# Altium schematic sheet Power_interconnect.SchDoc
size A3; SheetNumber: 3; SheetTotal: 6
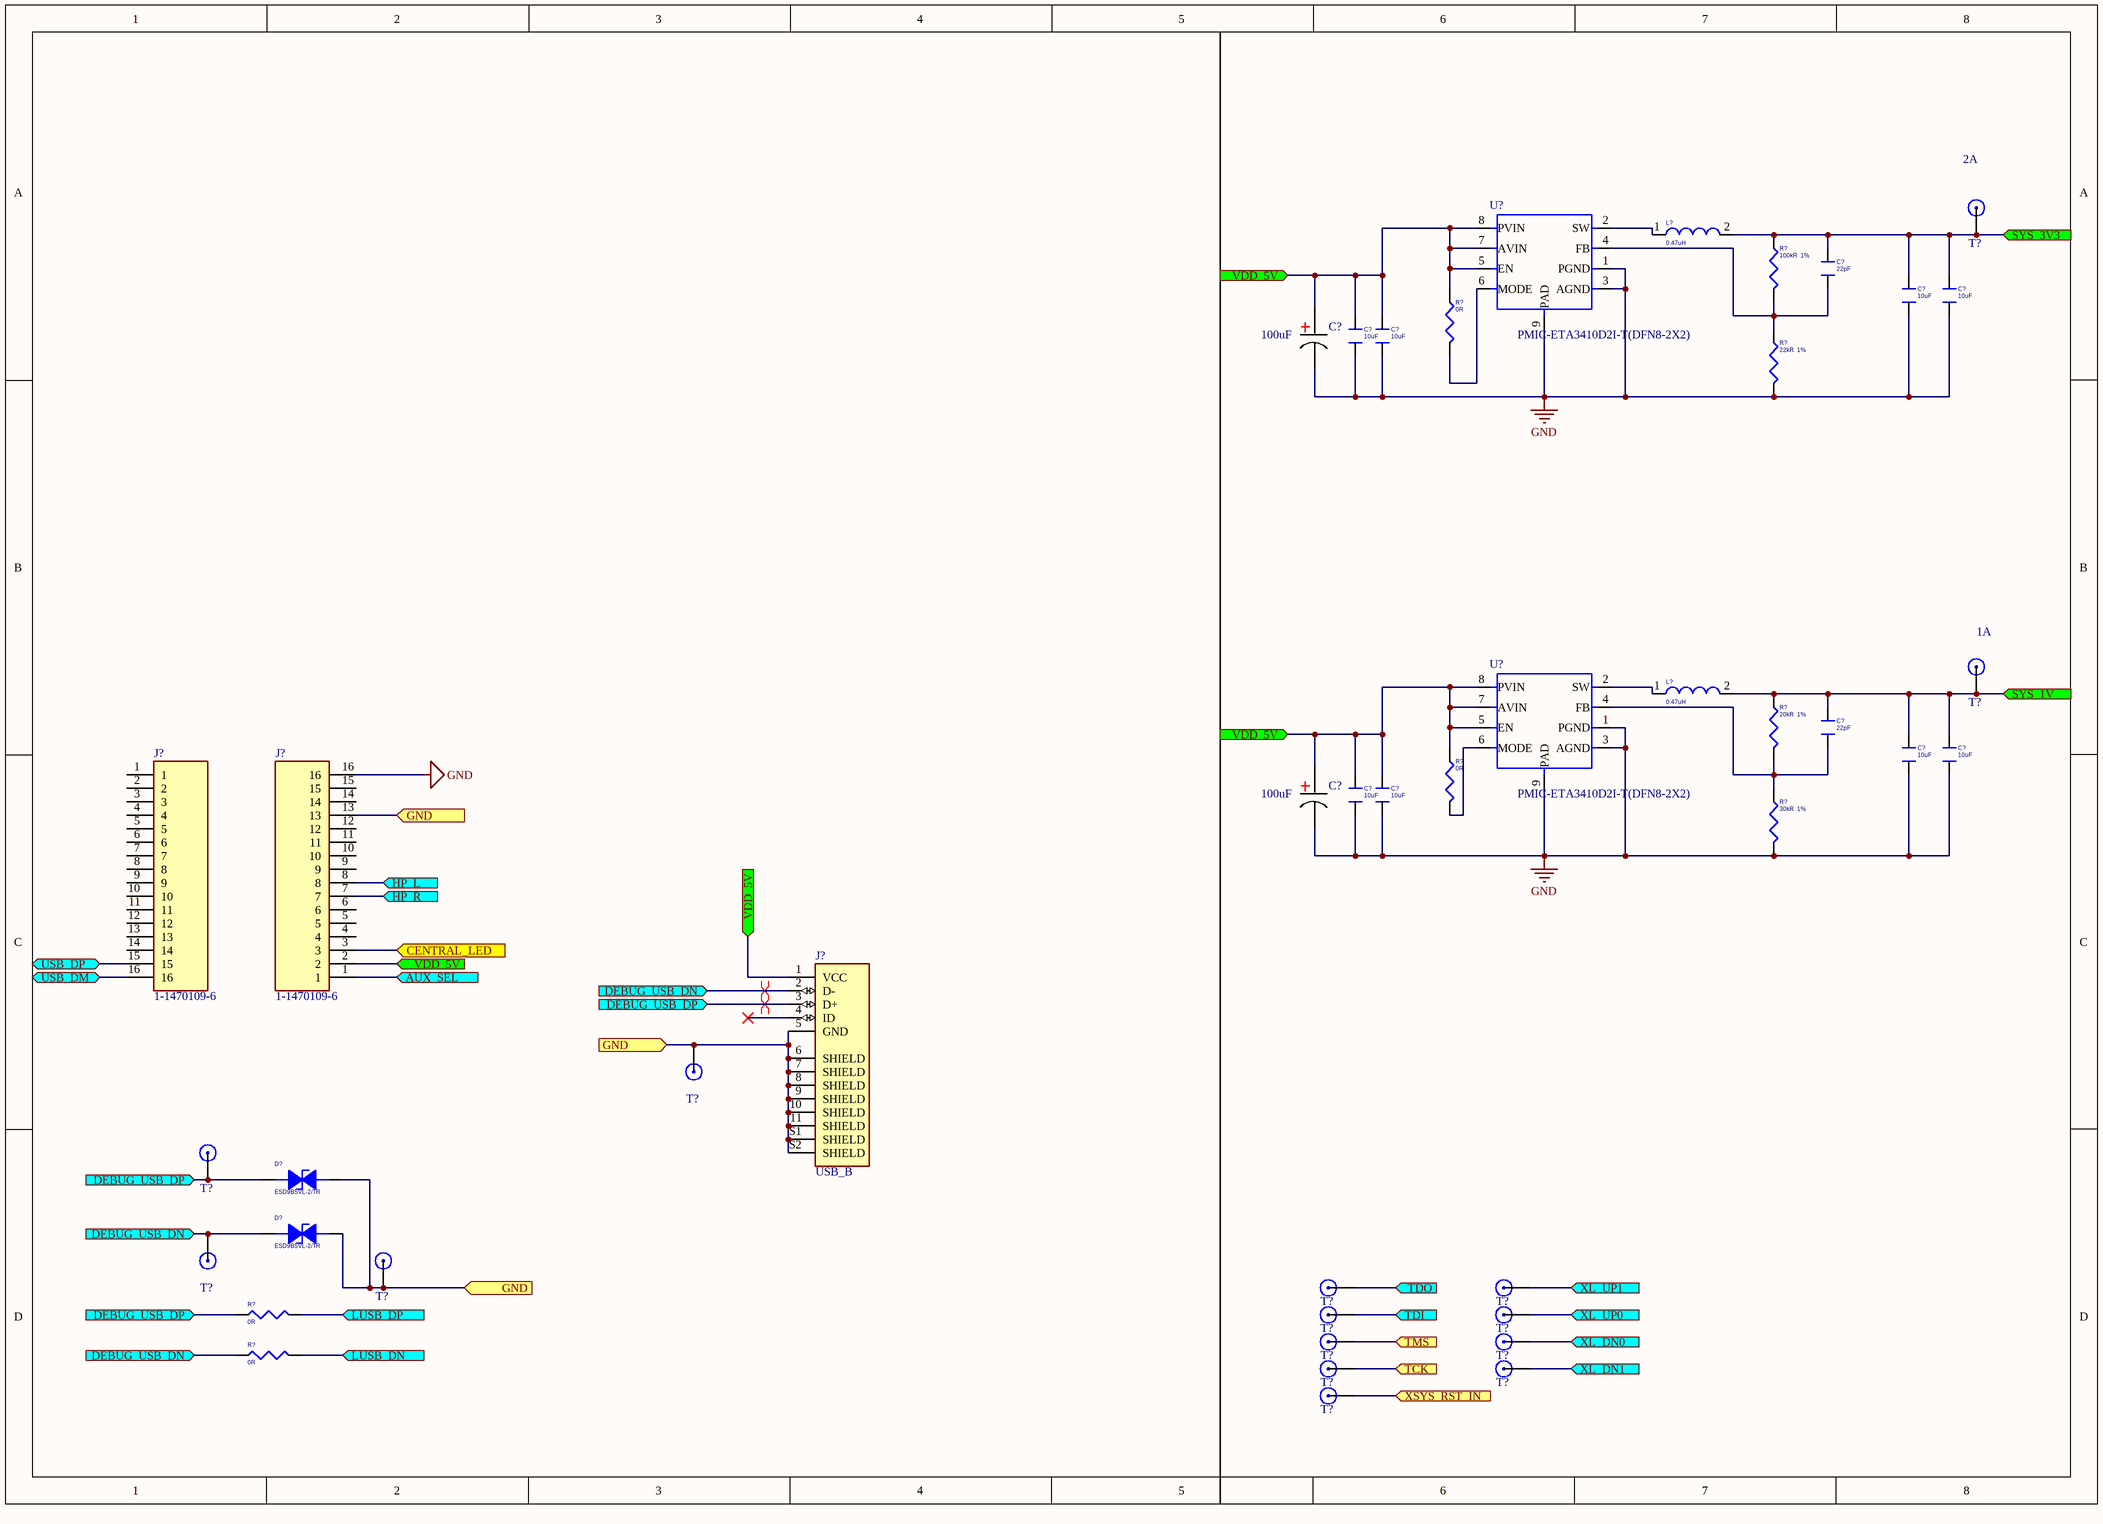
[diagram p0: Power_interconnect.SchDoc]

## Parts
(Parts that share a designator on the sheet are numbered #1, #2 ... from top to bottom, then left to right.)
C?#1  22pF  [C0603]
C?#2  10uF  [C0603]
C?#3  10uF  [C0603]
C?#4  10uF  [C0603]
C?#5  10uF  [C0603]
C?#6  100uF  [E_Capacitor]
C?#7  22pF  [C0603]
C?#8  10uF  [C0603]
C?#9  10uF  [C0603]
C?#10  10uF  [C0603]
C?#11  10uF  [C0603]
C?#12  100uF  [E_Capacitor]
D?#1  ESD9B5VL-2/TR  [ESD0402]
D?#2  ESD9B5VL-2/TR  [ESD0402]
J?#1  1-1470109-6  [TE_1-1470109-6]
J?#2  1-1470109-6  [TE_1-1470109-6]
J?#3  USB_B  [AMPHENOL_10103594-0001LF]
L?#1  0.47uH  [CD35]
L?#2  0.47uH  [CD35]
R?#1  100kR  1%  [R0402]
R?#2  0R  [R0402]
R?#3  22kR  1%  [R0402]
R?#4  20kR  1%  [R0402]
R?#5  0R  [R0402]
R?#6  30kR  1%  [R0402]
R?#7  0R  [R0402]
R?#8  0R  [R0402]
T?#1  Test_point  [Test_point]  (value not drawn)
T?#2  Test_point  [Test_point]  (value not drawn)
T?#3  Test_point  [Test_point]  (value not drawn)
T?#4  Test_point  [Test_point]  (value not drawn)
T?#5  Test_point  [Test_point]  (value not drawn)
T?#6  Test_point  [Test_point]  (value not drawn)
T?#7  Test_point  [Test_point]  (value not drawn)
T?#8  Test_point  [Test_point]  (value not drawn)
T?#9  Test_point  [Test_point]  (value not drawn)
T?#10  Test_point  [Test_point]  (value not drawn)
T?#11  Test_point  [Test_point]  (value not drawn)
T?#12  Test_point  [Test_point]  (value not drawn)
T?#13  Test_point  [Test_point]  (value not drawn)
T?#14  Test_point  [Test_point]  (value not drawn)
T?#15  Test_point  [Test_point]  (value not drawn)
U?#1  PMIC-ETA3410D2I-T(DFN8-2X2)  [ETA3410]
U?#2  PMIC-ETA3410D2I-T(DFN8-2X2)  [ETA3410]

## Ports
AUX_SEL (in), CENTRAL_LED (in), DEBUG_USB_DN (in), DEBUG_USB_DP (in), GND (in), HP_L (in), HP_R (in), LUSB_DN (in), LUSB_DP (in), SYS_1V (in), SYS_3V3 (in), TCK (in), TDI (in), TDO (in), TMS (in), USB_DM (bidir), USB_DP (bidir), VDD_5V (in), XL_DN0 (in), XL_DN1 (in), XL_UP0 (in), XL_UP1 (in), XSYS_RST_IN (in)

## Nets
GND: C?#2.1 C?#3.1 C?#4.1 C?#5.1 C?#6.1 C?#8.1 C?#9.1 C?#10.1 C?#11.1 C?#12.1 J?#1.16 R?#3.2 R?#6.2 U?#1.1(PGND) U?#1.3(AGND) U?#1.9(PAD) U?#2.1(PGND) U?#2.3(AGND) U?#2.9(PAD)
AUX_SEL: J?#1.1 ; port AUX_SEL
CENTRAL_LED: J?#1.3 ; port CENTRAL_LED
DEBUG_USB_DN: D?#2.1(ANODE) J?#3.2(D-) R?#8.1 T?#5.1 ; port DEBUG_USB_DN
DEBUG_USB_DP: D?#1.1(ANODE) J?#3.3(D+) R?#7.1 T?#4.1 ; port DEBUG_USB_DP
GND: D?#1.2(CATHODE) D?#2.2(CATHODE) J?#1.13 J?#3.5(GND) J?#3.6(SHIELD) J?#3.7(SHIELD) J?#3.8(SHIELD) J?#3.9(SHIELD) J?#3.10(SHIELD) J?#3.11(SHIELD) J?#3.S1(SHIELD) J?#3.S2(SHIELD) T?#3.1 T?#6.1 ; port GND  [a separate net that carries the same name]
HP_L: J?#1.8 ; port HP_L
HP_R: J?#1.7 ; port HP_R
LUSB_DN: R?#8.2 ; port LUSB_DN
LUSB_DP: R?#7.2 ; port LUSB_DP
SYS_1V: C?#7.2 C?#8.2 C?#9.2 L?#2.2 R?#4.1 T?#2.1 ; port SYS_1V
SYS_3V3: C?#1.2 C?#2.2 C?#3.2 L?#1.2 R?#1.1 T?#1.1 ; port SYS_3V3
TCK: T?#13.1 ; port TCK
TDI: T?#9.1 ; port TDI
TDO: T?#7.1 ; port TDO
TMS: T?#11.1 ; port TMS
USB_DM: J?#2.16 ; port USB_DM
USB_DP: J?#2.15 ; port USB_DP
VDD_5V: C?#4.2 C?#5.2 C?#6.2 C?#10.2 C?#11.2 C?#12.2 J?#1.2 J?#3.1(VCC) R?#2.1 R?#5.1 U?#1.5(EN) U?#1.7(AVIN) U?#1.8(PVIN) U?#2.5(EN) U?#2.7(AVIN) U?#2.8(PVIN) ; port VDD_5V
XL_DN0: T?#12.1 ; port XL_DN0
XL_DN1: T?#14.1 ; port XL_DN1
XL_UP0: T?#10.1 ; port XL_UP0
XL_UP1: T?#8.1 ; port XL_UP1
XSYS_RST_IN: T?#15.1 ; port XSYS_RST_IN
NetC?#1_1: C?#1.1 R?#1.2 R?#3.1 U?#1.4(FB)
NetC?#7_1: C?#7.1 R?#4.2 R?#6.1 U?#2.4(FB)
NetL?#1_1: L?#1.1 U?#1.2(SW)
NetL?#2_1: L?#2.1 U?#2.2(SW)
NetR?#2_2: R?#2.2 U?#1.6(MODE)
NetR?#5_2: R?#5.2 U?#2.6(MODE)

Not connected (* = marked no-connect by the designer): J?#1 4 5 6 9 10 11 12 14 15; J?#2 1 2 3 4 5 6 7 8 9 10 11 12 13 14; J?#3 4(ID)*

## Layout directives
differential pair: DEBUG_USB_DN, DEBUG_USB_DP

## Notes on the sheet
- (near T?#1) 2A
- (near T?#2) 1A

## Library data of the parts
C?#1-C?#5 C?#7-C?#11 = CAP_0603: CAP ±20%/10V/X5R/SMT0603
C?#6 = E_Capacitor
C?#12 = E_Capacitor: 10v
D?#1 D?#2 = 1_1.5KE100A_1: ESD9B5V Bidirection ESD Protection; 1ST PART DESCRIPTION: WILL ESD9B5V Bidirection ESD Protection
J?#3 = USB_B: USB - micro B USB 2.0 Receptacle Connector 5 Position Surface Mount, Right Angle; Through Hole; MP: 10103594-0001LF; Value: *; Package: None; Availability: Unavailable; Price: None
L?#1 L?#2 = INDUCTOR: Inductor 1150MA 4.0X4.0X2.0
R?#1-R?#8 = R_0603: RES 1/8W 5% SMT0603
U?#1 U?#2 = PMIC-ETA3410D2I-T(DFN8-2X2): 310030161; Package: None; Price: None; Value: *; MP: ETA3410D2I-T; Availability: Unavailable
J?#1 J?#2 = 1-1470109-6: Package: None; Price: None; Value: *; MP: 1-1470109-6; Availability: Unavailable